# EasyEDA Pro project STC8H1K16.epro

# Schematic Schematic1
Create Date: 2022-12-16; Page Name: P1; Project Name: STC8H1K16; Schematic Name: Schematic1; Update Date: 2022-12-17; Company: 嘉立创EDA; Page Size: A3; Version: V1.0
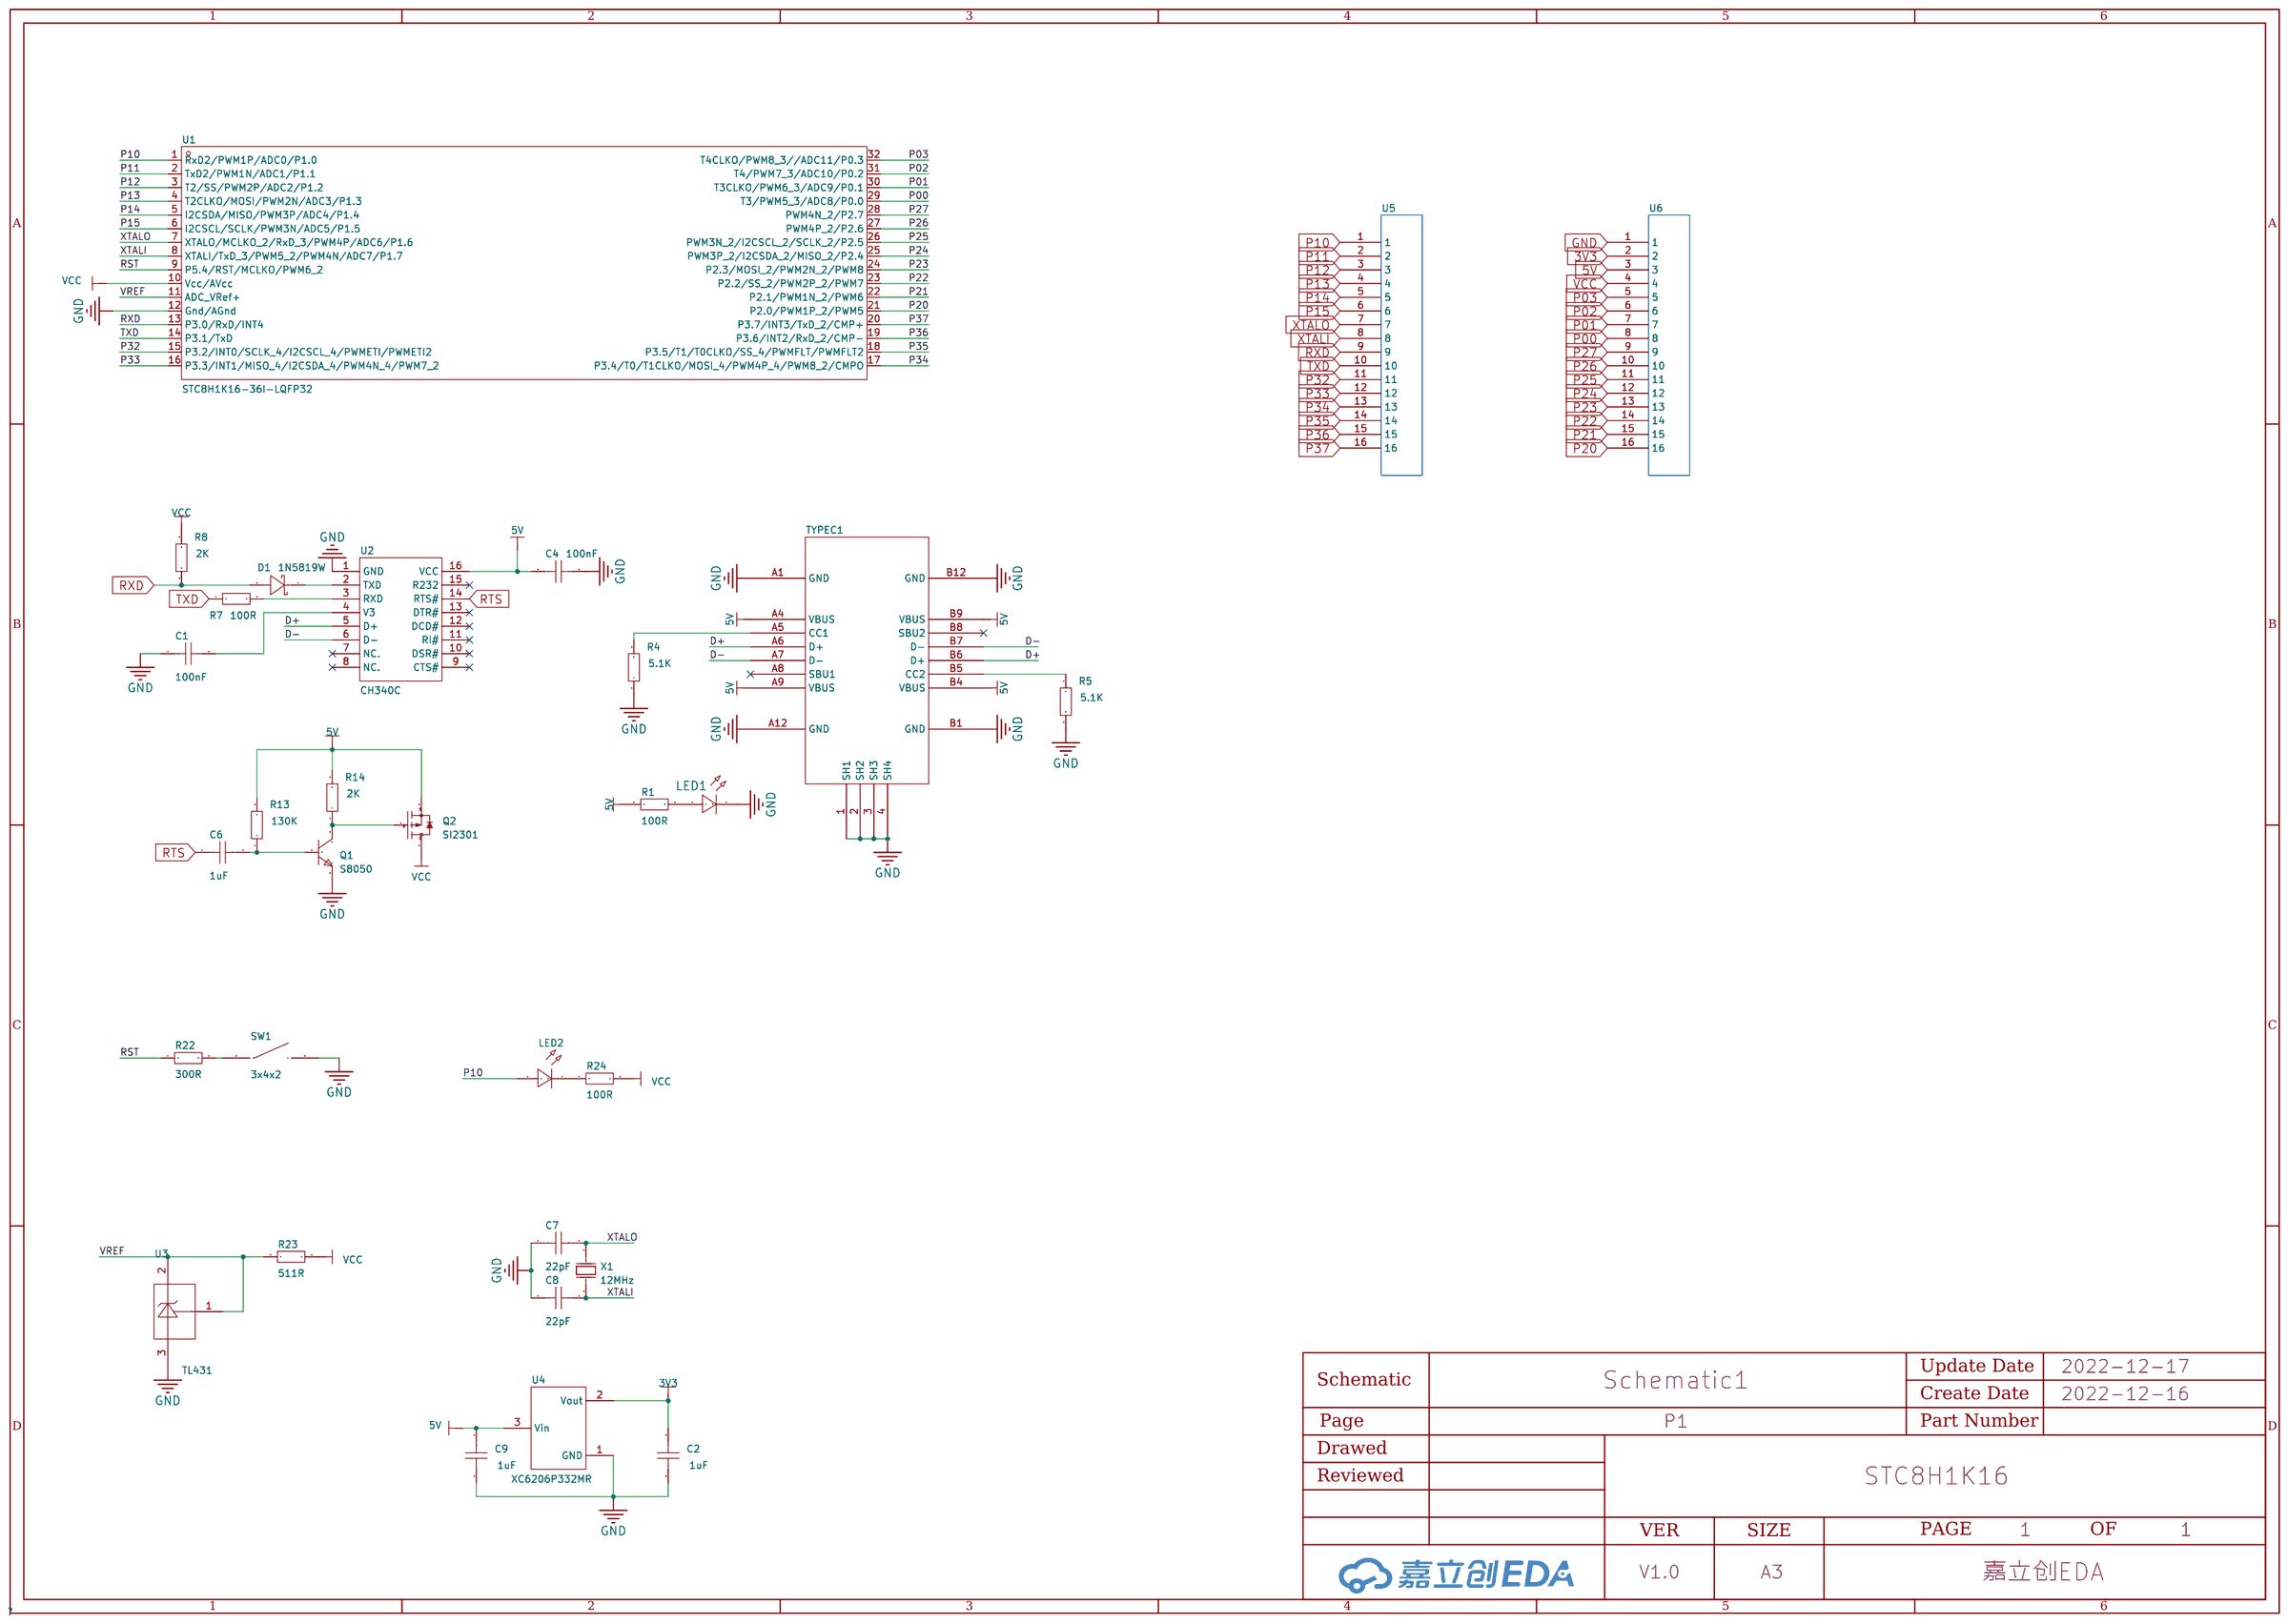
[diagram p0: schematic sheet]

## Parts
C1  100nF  [C0603]
C2  1uF  [C0603]
C4  100nF  [C0603]
C6  100nF  [C0603]
C7  22pF  [C0603]
C8  22pF  [C0603]
C9  1uF  [C0603]
D1  1N5819W  [SOD-323_L1.7-W1.3-LS2.6-RD-1]
LED1  -  [LED0805-RD_RED]
LED2  -  [LED_0805]
Q1  S8050  [SOT-23-3_L2.9-W1.3-P1.90-LS2.4-BR]
Q2  SI2301  [SOT-23-3_L2.9-W1.6-P1.90-LS2.8-BR]
R1  10K  [R0603]
R4  10K  [R0603]
R5  10K  [R0603]
R7  10K  [R0603]
R8  10K  [R0603]
R13  10K  [R0603]
R14  10K  [R0603]
R22  300R  [R0603]
R23  511R  [R0603]
R24  100R  [R0603]
SW1  3x4x2  [SW-SMD_L4.0-W2.9-LS5.0]
TYPEC1  -  [TypeC-16p]
U1  STC8H1K16-36I-LQFP32  [LQFP-32_L7.0-W7.0-P0.80-LS9.0-BL]
U2  CH340C  [SOP-16_L10.0-W3.9-P1.27-LS6.0-BL]
U3  TL431  [SOT-23-3_L2.9-W1.3-P1.90-LS2.4-BR]
U4  XC6206P332MR  [SOT-23-3_L2.9-W1.6-P1.90-LS2.8-BR]
U5  -  [Header-16P-2.54]
U6  -  [Header-16P-2.54]
X1  12MHz  [OSC-TH_L10.0-W4.5-P5.00]

## Library data of the parts
C1 C2 C4 C6-C9 = CAP_0603: Supplier Footprint: 0603
D1 = 1N5819WS S4: 二极管配置:-;直流反向耐压(Vr):40V;平均整流电流(Io):350mA;正向压降(Vf):600mV@200mA;反向电流(Ir):5A@30V;; LCSC Part Name: 40V 350mA 600mV@200mA; Supplier Part: C2939001; Manufacturer: KUU; Supplier Footprint: SOD-323; JLCPCB Part Class: 扩展库; Datasheet: https://atta.szlcsc.com/upload/public/pdf/source/20220104/284BA42B17809E9E0DF150FD0918852F.pdf; Supplier: LCSC; Reverse Voltage (Vr): 40V; Average Rectified Current (Io): 350mA; Forward Voltage (Vf@If): 600mV@200mA; Reverse Leakage Current (Ir): 5A@30V
LED1 = LED_0805-R: Supplier Footprint: 0805
LED2 = LED_0805-G: Supplier Footprint: 0805
Q1 = S8050: NPN 25V 500mA 120-400 SOT-23; Supplier Part: C2931719; Manufacturer: Doeshare(德芯); Supplier Footprint: SOT-23; JLCPCB Part Class: 扩展库; Datasheet: https://atta.szlcsc.com/upload/public/pdf/source/20220117/E6D3315E0D6ADDB25840BFFAC039C5C0.pdf; Supplier: LCSC
Q2 = SI2301_C2985938: 类型:P沟道;漏源电压(Vdss):20V;连续漏极电流(Id):3A;功率(Pd):1.25W;导通电阻(RDS(on)@Vgs,Id):90mΩ@4.5V,2.8A;阈值电压(Vgs(th)@Id):1V@250uA;栅极电荷(Qg@Vgs):10nC@4.5V;输入电容(Ciss@Vds):589pF@16V;反向传输电容(Crss@Vds):68pF@10V;工作温度:+150@(Tj);; LCSC Part Name: P沟道 20V 3A; Supplier Part: C2985938; Manufacturer: KUU; Supplier Footprint: SOT-23-3L; JLCPCB Part Class: 扩展库; Datasheet: https://atta.szlcsc.com/upload/public/pdf/source/20220328/BAD282C8065BB2F010ED3B5450E4D439.pdf; Supplier: LCSC; Type: P沟道; Drain Source Voltage (Vdss): 20V; Continuous Drain Current (Id): 3A; Power Dissipation (Pd): 1.25W; Drain Source On Resistance (RDS(on)@Vgs,Id): 90mΩ@4.5V,2.8A; Gate Threshold Voltage (Vgs(th)@Id): 1V@250uA; Total Gate Charge (Qg@Vgs): 10nC@4.5V; Input Capacitance (Ciss@Vds): 589pF@16V; Reverse Transfer Capacitance (Crss@Vds): 68pF@10V; Operating Temperature: +150@(Tj)
R1 R4 R5 R7 R8 R13 R14 R22-R24 = Res_0603: Supplier Footprint: 0603
SW1 = TS-1185-C-A-B-B: 触点电流:50mA;额定电压(DC):12V;绝缘电阻:100mΩ;电路结构:单刀单掷;安装方式:立贴;按钮形状:圆形按钮;按钮/盖帽颜色:蓝色;带灯:无;作用力:260gf;机械寿命:100000;工作温度:-30~+85;开关长度:4mm;开关宽度:3mm;开关高度:2mm;带支架:否;; LCSC Part Name: 3*4*2.0硅胶260gf; Supplier Part: C465999; Manufacturer: XKB Connectivity(中国星坤); Supplier Footprint: SMD; JLCPCB Part Class: 扩展库; Datasheet: https://atta.szlcsc.com/upload/public/pdf/source/20211011/1F231F77C87DDA3AFCA2BCBA34277182.pdf; Supplier: LCSC; Contact Current: 50mA; Voltage Rating (DC): 12V; Insulation Resistance: 100mΩ; Circuit: 单刀单掷; Mounting Style: 立贴; Actuator Style: 圆形按钮; Actuator/Cap Color: 蓝色; With Lamp: 无; Operating Force: 260gf; Mechanical Life: 100000; Operating Temperature: -30~+85; Switch Length: 4mm; Switch Width: 3mm; Switch Height: 2mm; Strike Gundam: 否
TYPEC1 = TypeC-16P
U1 = STC8H1K16-36I-LQFP32: Supplier Part: C914617; Manufacturer: STC(宏晶); Supplier Footprint: LQFP-32; JLCPCB Part Class: 扩展库; Datasheet: https://atta.szlcsc.com/upload/public/pdf/source/20220208/F43AF8AFB82417D1483669F3A0ABE01D.pdf; Supplier: LCSC
U2 = CH340C: 类型:Transceiver;协议类别:USB 2.0;驱动器/接收器数:-;数据速率:2Mbps;; Supplier Part: C84681; Manufacturer: WCH(南京沁恒); Supplier Footprint: SOP-16_150mil; JLCPCB Part Class: 扩展库; Datasheet: https://atta.szlcsc.com/upload/public/pdf/source/20200819/C84681_ADBED554CE321879DBD6B1D06488689C.pdf; Supplier: LCSC; Type: Transceiver; Protocol: USB 2.0; Data Rate: 2Mbps; Supply Voltage: 3.3V, 5V
U3 = TL431_C2904832: 电压基准类型:并联;输出类型:可调;输入电压:37V;输出电压:2.5V~36V;输出电流:-;精度:1%;温度系数:-;静态电流:-;最小阴极电流调节:1mA;噪声(0.1Hz-10Hz):-;噪声(10Hz-10kHz):-;动态阻抗:0.15Ω;工作温度:-25℃~+85℃@(Topr);; LCSC Part Name: 并联 2.5V~36V; Supplier Part: C2904832; Manufacturer: YONGYUTAI(永裕泰); Supplier Footprint: SOT-23; JLCPCB Part Class: 扩展库; Datasheet: https://atta.szlcsc.com/upload/public/pdf/source/20211011/73AEA5281D6620D507A69EF0BBD25925.pdf; Supplier: LCSC; Reference Type: 并联; Output Type: 可调; Input Voltage: 37V; Output Voltage: 2.5V~36V; Tolerance: 1%; Minimum Cathode Current for Regulation: 1mA; Dynamic Impedance: 0.15Ω; Operating Temperature: -25℃~+85℃@(Topr)
U4 = XC6206P332MR_C5446: 输出类型:固定;输出极性:正;输出通道数:1;最大输入电压:6V;输出电压:3.3V;压差:680mV@(100mA);输出电流:200mA;电源纹波抑制比(PRSS):-;; LCSC Part Name: Vin=6V Vout=3.3V 200mA; Supplier Part: C5446; Manufacturer: TOREX(特瑞仕); Supplier Footprint: SOT-23-3L; JLCPCB Part Class: 基础库; Datasheet: https://atta.szlcsc.com/upload/public/pdf/source/20130801/1457706628791.pdf; Supplier: LCSC; Output Type: 固定; Output Polarity: 正; Number of Outputs: 1; Maximum Input Voltage: 6V; Output Voltage: 3.3V; Dropout Voltage: 680mV@(100mA); Output Current: 200mA
U5 U6 = Header-16P-2.54: 2.54 mm 排针
X1 = X49SD294912MSD2SC: 晶振类型:49S晶振;频率:29.4912MHz;频率公差:±20ppm;频率稳定度:±30ppm;负载电容:20pF;工作温度:-20℃~+70℃;; LCSC Part Name: HC-49US 29.4912MHz ±20ppm 20pF; Supplier Part: C2219; Manufacturer: YXC(扬兴晶振); Supplier Footprint: HC-49S-2P; JLCPCB Part Class: 扩展库; Datasheet: https://atta.szlcsc.com/upload/public/pdf/source/20210903/A997D130AE99CBB55D9024F9BE6DA174.pdf; Supplier: LCSC; Crystal Type: 49S晶振; Frequency Tolerance: ±20ppm; Frequency Stability: ±30ppm; Load Capacitance: 20pF; Operating Temperature: -20℃~+70℃

## Nets
3V3: C2.2 U4.2(Vout) U6.2
5V: C4.2 C9.2 Q2.2(S) R1.1 R13.2 R14.2 TYPEC1.A4(VBUS) TYPEC1.A9(VBUS) TYPEC1.B4(VBUS) TYPEC1.B9(VBUS) U2.16(VCC) U4.3(Vin) U6.3
GND: C1.1 C2.1 C4.1 C7.1 C8.1 C9.1 LED1.1(C) Q1.2(E) R4.1 R5.2 SW1.2 TYPEC1.1(SH1) TYPEC1.2(SH2) TYPEC1.3(SH3) TYPEC1.4(SH4) TYPEC1.A1(GND) TYPEC1.A12(GND) TYPEC1.B1(GND) TYPEC1.B12(GND) U1.12(Gnd/AGnd) U2.1(GND) U3.3(A) U4.1(GND) U6.1
VCC: Q2.3(D) R8.2 R23.2 R24.2 U1.10(Vcc/AVcc) U6.4
D+: TYPEC1.A6(D+) TYPEC1.B6(D+) U2.5(D+)
D-: TYPEC1.A7(D-) TYPEC1.B7(D-) U2.6(D-)
P00: U1.29(T3/PWM5_3/ADC8/P0.0) U6.8
P01: U1.30(T3CLKO/PWM6_3/ADC9/P0.1) U6.7
P02: U1.31(T4/PWM7_3/ADC10/P0.2) U6.6
P03: U1.32(T4CLKO/PWM8_3//ADC11/P0.3) U6.5
P10: LED2.2(A) U1.1(RxD2/PWM1P/ADC0/P1.0) U5.1
P11: U1.2(TxD2/PWM1N/ADC1/P1.1) U5.2
P12: U1.3(T2/SS/PWM2P/ADC2/P1.2) U5.3
P13: U1.4(T2CLKO/MOSI/PWM2N/ADC3/P1.3) U5.4
P14: U1.5(I2CSDA/MISO/PWM3P/ADC4/P1.4) U5.5
P15: U1.6(I2CSCL/SCLK/PWM3N/ADC5/P1.5) U5.6
P20: U1.21(P2.0/PWM1P_2/PWM5) U6.16
P21: U1.22(P2.1/PWM1N_2/PWM6) U6.15
P22: U1.23(P2.2/SS_2/PWM2P_2/PWM7) U6.14
P23: U1.24(P2.3/MOSI_2/PWM2N_2/PWM8) U6.13
P24: U1.25(PWM3P_2/I2CSDA_2/MISO_2/P2.4) U6.12
P25: U1.26(PWM3N_2/I2CSCL_2/SCLK_2/P2.5) U6.11
P26: U1.27(PWM4P_2/P2.6) U6.10
P27: U1.28(PWM4N_2/P2.7) U6.9
P32: U1.15(P3.2/INT0/SCLK_4/I2CSCL_4/PWMETI/PWMETI2) U5.11
P33: U1.16(P3.3/INT1/MISO_4/I2CSDA_4/PWM4N_4/PWM7_2) U5.12
P34: U1.17(P3.4/T0/T1CLKO/MOSI_4/PWM4P_4/PWM8_2/CMPO) U5.13
P35: U1.18(P3.5/T1/T0CLKO/SS_4/PWMFLT/PWMFLT2) U5.14
P36: U1.19(P3.6/INT2/RxD_2/CMP-) U5.15
P37: U1.20(P3.7/INT3/TxD_2/CMP+) U5.16
RST: R22.1 U1.9(P5.4/RST/MCLKO/PWM6_2)
RTS: C6.1 U2.14(RTS#)
RXD: D1.2(A) R8.1 U1.13(P3.0/RxD/INT4) U5.9
TXD: R7.1 U1.14(P3.1/TxD) U5.10
VREF: R23.1 U1.11(ADC_VRef+) U3.1(REF) U3.2(K)
XTALI: C8.2 U1.8(XTALI/TxD_3/PWM5_2/PWM4N/ADC7/P1.7) U5.8 X1.2(OSC2)
XTALO: C7.2 U1.7(XTALO/MCLKO_2/RxD_3/PWM4P/ADC6/P1.6) U5.7 X1.1(OSC1)
$1N1368: R7.2 U2.3(RXD)
$1N1373: C1.2 U2.4(V3)
$1N1374: D1.1(K) U2.2(TXD)
$1N1821: C6.2 Q1.1(B) R13.1
$1N1822: Q1.3(C) Q2.1(G) R14.1
$1N2730: LED1.2(A) R1.2
$1N2745: R4.2 TYPEC1.A5(CC1)
$1N2747: R5.1 TYPEC1.B5(CC2)
$1N3640: R22.2 SW1.1
$1N4944: LED2.1(C) R24.1

Not connected (* = marked no-connect by the designer): TYPEC1 A8(SBU1)* B8(SBU2)*; U2 7(NC.)* 8(NC.)* 9(CTS#)* 10(DSR#)* 11(RI#)* 12(DCD#)* 13(DTR#)* 15(R232)*

# Board PCB1
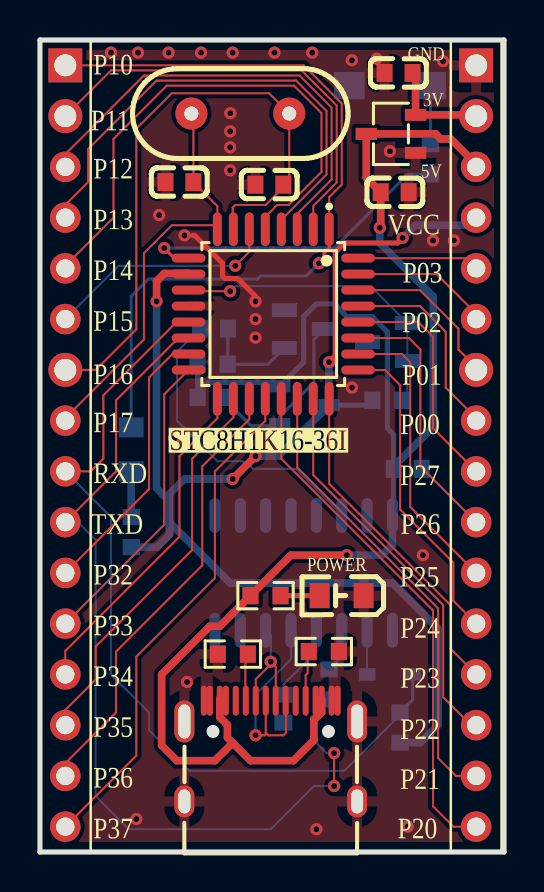
[diagram p1: board, top side]
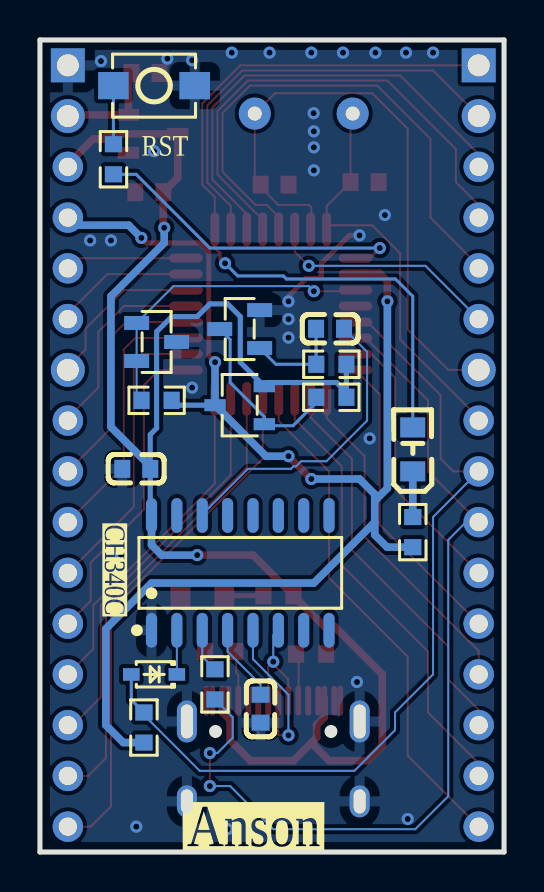
[diagram p2: board, bottom side, seen from below]

Outline 23.24 x 40.64 mm; copper layers: Top Layer, Bottom Layer. Coordinates in mm from the lower left corner of the outline.
Outline path: 0,40.64 0,0 23.24,0 23.24,40.64 0,40.64
Stack: Top Layer 0.035mm / Dielectric1 1.51mm FR4 er 4.5 / Bottom Layer 0.035mm

## Design rules (mm)
spacing safeClearance (default): track to track 0.152, other pairs 0.152 to 0.3
track width trackWidth (default): min 0.102, default 0.254, max 2.54
differential pair differentialPair (default): width min 0.127, default 0.254, max 2.54; gap min 0.152, default 0.152
via viaSize (default): diameter min 0.5, default 0.61, max 10; hole min 0.3, default 0.305, max 6
net GND uses copperRegion1

## Placement (name value [footprint] x y rotation side)
C1  100nF  [C0603]  12.19 7.17 90 bottom
C2  1uF  [C0603]  17.96 38.99 0 top
C4  100nF  [C0603]  18.41 19.18 180 bottom
C6  100nF  [C0603]  8.71 26.19 0 bottom
C7  22pF  [C0603]  11.49 33.4 0 top
C8  22pF  [C0603]  6.99 33.53 0 top
C9  1uF  [C0603]  17.76 33.02 180 top
D1  1N5819W  [SOD-323_L1.7-W1.3-LS2.6-RD-1]  17.53 8.89 0 bottom
LED1  -  [LED0805-RD_RED]  15.11 12.83 180 top
LED2  -  [LED_0805]  4.57 20.2 90 bottom
Q1  S8050  [SOT-23-3_L2.9-W1.3-P1.90-LS2.4-BR]  13.24 26.17 180 bottom
Q2  SI2301  [SOT-23-3_L2.9-W1.6-P1.90-LS2.8-BR]  13.24 22.36 180 bottom
R1  10K  [R0603]  11.3 12.83 0 top
R4  10K  [R0603]  9.66 9.91 0 top
R5  10K  [R0603]  14.22 10.03 0 top
R7  10K  [R0603]  14.48 8.39 90 bottom
R8  10K  [R0603]  18.03 6.23 270 bottom
R13  10K  [R0603]  8.65 24.41 180 bottom
R14  10K  [R0603]  8.65 22.76 180 bottom
R22  300R  [R0603]  19.56 34.67 90 bottom
R23  511R  [R0603]  17.4 22.61 180 bottom
R24  100R  [R0603]  4.57 16.01 270 bottom
SW1  3x4x2  [SW-SMD_L4.0-W2.9-LS5.0]  17.53 38.35 180 bottom
TYPEC1  -  [TypeC-16p]  11.56 4.06 270 top
U1  STC8H1K16-36I-LQFP32  [LQFP-32_L7.0-W7.0-P0.80-LS9.0-BL]  11.68 26.92 180 top
U2  CH340C  [SOP-16_L10.0-W3.9-P1.27-LS6.0-BL]  13.21 13.97 180 bottom
U3  TL431  [SOT-23-3_L2.9-W1.3-P1.90-LS2.4-BR]  17.4 25.53 0 bottom
U4  XC6206P332MR  [SOT-23-3_L2.9-W1.6-P1.90-LS2.8-BR]  17.58 35.94 0 top
U5  -  [Header-16P-2.54]  0 40.64 270 top
U6  -  [Header-16P-2.54]  20.57 40.64 270 top
X1  12MHz  [OSC-TH_L10.0-W4.5-P5.00]  10.03 36.96 270 top

## Footprints (pads in the part's own frame, mm; a bottom-side part is the same pattern mirrored in y, then rotated)
C0603
  rect 0.8x0.9 smd: 1(-0.7,0) 2(0.7,0)
Header-16P-2.54
  rect 1.7x1.7 hole 1.1: 1(1.27,1.27)
  round 1.7 hole 1.1: 2(3.81,1.27) 7(16.51,1.27)
  round 1.524 hole 0.914: 3(6.35,1.27) 4(8.89,1.27) 5(11.43,1.27) 6(13.97,1.27) 8(19.05,1.27) 9(21.59,1.27) 10(24.13,1.27) 11(26.67,1.27) 12(29.21,1.27) 13(31.75,1.27) 14(34.29,1.27) 15(36.83,1.27) 16(39.37,1.27)
LED0805-RD_RED
  rect 1x1.25 smd: 1(-1.1,0) 2(1.1,0)
LED_0805
  rect 1x1.25 smd: 1(-1.15,0.005) 2(1.05,0.005)
LQFP-32_L7.0-W7.0-P0.80-LS9.0-BL
  oval 0.448x1.684 smd: 1(-2.8,-4.242) 2(-2,-4.242) 3(-1.2,-4.242) 4(-0.4,-4.242) 5(0.4,-4.242) 6(1.2,-4.242) 7(2,-4.242) 8(2.8,-4.242) 17(2.8,4.242) 18(2,4.242) 19(1.2,4.242) 20(0.4,4.242) 21(-0.4,4.242) 22(-1.2,4.242) 23(-2,4.242) 24(-2.8,4.242)
  oval 1.684x0.448 smd: 9(4.242,-2.8) 10(4.242,-2) 11(4.242,-1.2) 12(4.242,-0.4) 13(4.242,0.4) 14(4.242,1.2) 15(4.242,2) 16(4.242,2.8) 25(-4.242,2.8) 26(-4.242,2) 27(-4.242,1.2) 28(-4.242,0.4) 29(-4.242,-0.4) 30(-4.242,-1.2) 31(-4.242,-2) 32(-4.242,-2.8)
OSC-TH_L10.0-W4.5-P5.00
  round 1.6 hole 0.701: 1(0,2.451) 2(0,-2.451)
R0603
  rect 0.806x0.864 smd: 1(-0.753,0) 2(0.753,0)
SOD-323_L1.7-W1.3-LS2.6-RD-1
  rect 0.831x0.63 smd: 1(-1.141,0) 2(1.141,0)
SOP-16_L10.0-W3.9-P1.27-LS6.0-BL
  oval 0.56x1.745 smd: 1(-4.445,-2.873) 2(-3.175,-2.873) 3(-1.905,-2.873) 4(-0.635,-2.873) 5(0.635,-2.873) 6(1.905,-2.873) 7(3.175,-2.873) 8(4.445,-2.873) 9(4.445,2.873) 10(3.175,2.873) 11(1.905,2.873) 12(0.635,2.873) 13(-0.635,2.873) 14(-1.905,2.873) 15(-3.175,2.873) 16(-4.445,2.873)
SOT-23-3_L2.9-W1.3-P1.90-LS2.4-BR
  rect 1.25x0.7 smd: 1(1,-0.95) 2(1,0.95) 3(-1,0)
SOT-23-3_L2.9-W1.6-P1.90-LS2.8-BR
  rect 1.07x0.6 smd: 1(1.235,-0.95) 2(1.235,0.95) 3(-1.235,0)
SW-SMD_L4.0-W2.9-LS5.0
  rect 1.53x1.36 smd: 1(-2.035,0) 2(2.035,0)
TypeC-16p
  oval 2.1x1 hole 1.7x0.6: 1(-2.47,-4.325) 4(-2.47,4.325)
  oval 1.6x1 hole 1.2x0.6: 2(1.53,-4.325) 3(1.53,4.325)
  rrect 1.5x0.3 smd: A1(-3.51,-3.35) A4(-3.51,-2.55) A5(-3.51,-1.25) A6(-3.51,-0.25) A7(-3.51,0.25) A8(-3.51,1.25) A9(-3.51,2.55) A12(-3.51,3.35) B1(-3.51,3.05) B4(-3.51,2.25) B5(-3.51,1.75) B6(-3.51,0.75) B7(-3.51,-0.75) B8(-3.51,-1.75) B9(-3.51,-2.25) B12(-3.51,-3.05)

## Nets
As in the schematic.

Pads without a net: TYPEC1 A8 B8; U2 7 8 9 10 11 12 13 15

## Via types
v1: diameter 0.61, hole 0.305, Top Layer to Bottom Layer, 44 vias

## Routing (per net, layer and track width the routed paths; a pad name or vN(x,y) marks a point on that pad's centre or on a via; arc(x,y) is an arc through that point)
3V3: length 5.3
  Top Layer w0.381: 21.97,36.83 21.91,36.89 U4.2 18.81,38.83 C2.2
5V: length 82.7
  Top Layer w0.381: 9.65,5.46 9.39,5.72 9.39,6.36 9.01,6.74 9.01,7.7 ; 9.65,5.46 10.54,4.57 12.7,4.57 13.72,5.59 13.72,6.6 14.11,7 14.11,7.7 ; 9.65,5.46 8.76,4.57 6.86,4.57 6.1,5.33 6.1,8.89 8.51,11.3 9.02,11.3 10.54,12.83 12.57,14.86 v1(15.37,14.86) ; 21.97,34.29 20.57,35.69 20.07,35.69 19.81,35.94 U4.3 16.34,33.74 C9.2 17.06,31.29 v1(17.02,31.24)
  Bottom Layer w0.152: 7.9,23.01 R14.2
  Bottom Layer w0.254: R13.2 7.9,23.01 8.38,23.5 11.82,23.5 Q2.2 12.01,23.31 13.21,24.51 13.21,26.8 13.84,27.43 14.73,27.43 15.37,26.8 16.64,26.8 17.4,26.03 17.4,21.21 17.72,20.89 17.72,16.91 U2.16
  Bottom Layer w0.381: v1(15.37,14.86) 17.15,14.86 17.65,15.37 U2.16 ; 17.72,19.3 19.69,21.27 19.69,27.81 17.02,30.48 v1(17.02,31.24)
GND: length 5.1
  Top Layer w0.254: v1(10.79,27.56) 10.79,27.81 9.91,28.7 9.27,28.7 9.14,28.83 9.14,29.46 7.75,30.86 7.62,30.86
  vias: v1(3.56,40) v1(4.83,1.65) v1(4.91,40) v1(5.97,31.88) v1(6.44,40) v1(6.73,20.7) v1(7.24,30.86) v1(7.37,8.51) v1(8.07,40) v1(9.54,36.98) v1(9.53,36.07) v1(9.53,35.27) v1(9.53,34.12) v1(9.65,40) v1(10.79,26.67) v1(10.79,25.74) v1(11.74,40) v1(13.64,40) v1(13.84,1.14) v1(15.62,39.62) v1(15.62,23.24) v1(16.86,39.7) v1(17.53,35.07) v1(18.41,1.27) v1(19.18,14.86) v1(19.69,30.61) v1(20.18,39.58) v1(20.73,30.61)
VCC: length 67.7
  Top Layer w0.254: v1(18.16,30.73) 17.91,30.48 15.24,30.48 14.79,30.03 14.79,24.83 v1(14.47,24.52)
  Top Layer w0.381: v1(5.84,27.56) 5.84,28.58 6.22,28.96 7.41,28.96 U1.10 ; v1(9.65,18.67) v1(10.79,19.81)
  Bottom Layer w0.254: Q2.3 16.4,22.36 R23.2
  Bottom Layer w0.381: 6.48,16.51 6.48,15.88 5.86,15.26 4.57,15.26 ; 6.48,16.51 9.53,13.46 17.65,13.46 19.94,11.18 19.94,6.35 19.07,5.48 R8.2 ; 6.48,16.51 6.48,17.57 ; U6.4 21.46,31.37 18.8,31.37 v1(18.16,30.73) ; v1(10.79,19.81) 11.92,19.81 Q2.3 v1(14.47,24.52) ; 6.48,17.57 6.48,17.91 7.24,18.67 v1(9.65,18.67) ; 6.48,17.57 5.84,18.21 v1(5.84,27.56)
D+: length 11.2
  Top Layer w0.102: 11.35,5.93 11.26,5.84 v1(10.79,5.84) ; 11.35,5.93 11.43,5.84 12.19,5.84 12.32,5.97 12.32,7.69 12.31,7.7 ; 11.35,5.93 11.31,5.97 11.31,7.7
  Bottom Layer w0.102: U2.5 12.57,9.65 10.79,7.87 v1(10.79,5.84)
D-: length 5.7
  Top Layer w0.102: 10.81,7.7 10.81,8.65 11.56,9.4 v1(11.56,9.53) 11.81,9.27 11.81,7.7 11.81,7.7
  Bottom Layer w0.102: U2.6 11.56,10.84 v1(11.56,9.53)
P00: length 10.1
  Top Layer w0.102: 21.97,21.59 20.32,23.24 20.32,26.03 19.03,27.32 U1.29
P01: length 8.3
  Top Layer w0.102: U1.30 19.03,28.12 20.96,26.19 20.96,25.15 21.97,24.13
P02: length 7.1
  Top Layer w0.102: 21.97,26.67 21.97,26.81 19.86,28.92 U1.31
P03: length 6.3
  Top Layer w0.102: U1.32 15.93,29.72 21.46,29.72 21.97,29.21
P10: length 39.8
  Top Layer w0.102: U5.1 13.21,39.37 15.11,37.47 15.11,33.4 14.48,32.77 U1.1
  Top Layer w0.152: U1.1 14.48,30.23 14.22,29.97 14.22,29.72 v1(13.97,29.46)
  Bottom Layer w0.152: LED2.2 4.57,27.81 5.44,28.68 10.9,28.68 11.05,28.83 13.34,28.83 v1(13.97,29.46)
P11: length 21.9
  Top Layer w0.102: U5.2 3.56,39.12 13.1,39.12 14.86,37.36 14.86,33.51 13.68,32.33 U1.2
P12: length 23.1
  Top Layer w0.102: U1.3 12.88,31.93 14.6,33.66 14.6,37.25 13,38.86 5.21,38.86 1.27,34.92 U5.3
P13: length 24.7
  Top Layer w0.102: U5.4 1.27,32.39 2.41,33.53 2.41,35.18 5.84,38.61 12.83,38.61 14.35,37.08 14.35,33.91 12.08,31.64 U1.4
P14: length 26.9
  Top Layer w0.102: U5.5 1.27,29.34 3.68,31.75 3.68,35.69 6.35,38.35 12.72,38.35 14.1,36.98 14.1,34.04 12.45,32.39 11.88,32.39 11.28,31.78 U1.5
P15: length 11.7
  Top Layer w0.102: v1(9.78,29.34) 10.48,30.04 U1.6
  Bottom Layer w0.102: v1(9.78,29.34) 3.94,29.34 U5.6
P20: length 26.1
  Top Layer w0.102: U1.21 12.08,19.69 19.69,12.09 19.69,2.29 20.7,1.27 U6.16
P21: length 23.2
  Top Layer w0.102: U6.15 20.83,3.81 19.94,4.7 19.94,12.19 12.88,19.25 U1.22
P22: length 19.9
  Top Layer w0.102: U6.14 21.59,6.35 20.19,7.75 20.19,12.36 13.68,18.87 U1.23
P23: length 16.8
  Top Layer w0.102: U1.24 14.48,18.43 20.57,12.34 20.57,10.16 U6.13
P24: length 15.9
  Top Layer w0.102: U1.25 17.28,24.12 18.03,23.37 18.03,17.14 20.7,14.48 20.7,12.57 U6.12
P25: length 14.7
  Top Layer w0.102: U6.11 18.54,17.27 18.54,24.51 18.13,24.92 U1.26
P26: length 13.2
  Top Layer w0.102: U6.10 19.05,19.3 19.05,25.15 18.47,25.72 U1.27
P27: length 11.7
  Top Layer w0.102: U1.28 18.94,26.52 19.69,25.78 19.69,21.21 U6.9
P32: length 14
  Top Layer w0.102: U5.11 5.46,18.16 5.46,23.75 6.64,24.92 U1.15
P33: length 15.3
  Top Layer w0.102: U1.16 6.22,22.91 6.22,16.38 U5.12
P34: length 16.9
  Top Layer w0.102: U5.13 1.27,10.06 6.99,15.78 6.99,19.81 8.88,21.71 U1.17
P35: length 19.8
  Top Layer w0.102: U1.18 9.68,21.75 7.62,19.69 7.62,15.11 2.79,10.29 2.79,8.64 1.27,7.11 U5.14
P36: length 22.7
  Top Layer w0.102: U5.15 1.27,4.44 3.81,6.98 3.81,10.03 8.13,14.35 8.13,19.3 10.48,21.66 U1.19
P37: length 25.6
  Top Layer w0.102: U5.16 4.83,4.83 4.83,9.78 8.76,13.72 8.76,19.05 11.28,21.57 U1.20
RST: length 16.3
  Top Layer w0.152: v1(6.22,30.23) 6.72,29.72 U1.9
  Bottom Layer w0.152: R22.1 18.42,33.92 14.73,30.23 v1(6.22,30.23)
RTS: length 15.3
  Bottom Layer w0.102: U2.14 15.11,16.89 12.83,19.18 10.67,19.18 10.54,19.3 10.41,19.3 10.16,19.56 8.89,19.56 6.86,21.59 6.86,25.03 C6.1
RXD: length 42.7
  Top Layer w0.102: U5.9 2.54,19.05 3.18,19.69 3.18,22.86 6.84,26.52 U1.13
  Bottom Layer w0.102: U5.9 3.56,16.76 3.56,8.89 5.46,6.98 5.46,6.1 7.49,4.06 15.24,4.06 18.03,6.86 R8.1
  Bottom Layer w0.152: R8.1 18.67,7.62 D1.2
TXD: length 45.7
  Top Layer w0.102: v1(14.73,4.95) v1(14.73,3.3) ; U1.14 6.93,25.72 3.81,22.61 3.81,19.05 U5.10
  Bottom Layer w0.102: v1(14.73,4.95) 14.35,4.95 13.59,5.72 13.59,6.75 14.48,7.64 ; U5.10 1.91,16.51 2.79,15.62 2.79,2.79 4.44,1.14 11.56,1.14 13.72,3.3 v1(14.73,3.3)
VREF: length 15.8
  Top Layer w0.102: U1.11 7.5,28.07 v1(9.53,28.07)
  Bottom Layer w0.102: v1(9.53,28.07) 9.78,28.32 16.56,28.32 U3.1 U3.2 18.4,22.85 R23.1
XTALI: length 20.7
  Top Layer w0.102: X1.2 7.69,36.85 C8.2 8.88,32.33 U1.8 8.68,31.37 6.6,31.37 5.21,29.97 5.21,25.65 1.27,21.72 U5.8
XTALO: length 31.1
  Top Layer w0.102: U1.7 9.65,31.2 9.65,32.26 9.78,32.39 11.3,32.39 11.94,33.02 11.94,33.15 C7.2 12.48,33.7 X1.1 11.47,37.97 6.6,37.97 4.83,36.19 4.83,26.16 2.79,24.13 U5.7
$1N1368: length 2.2
  Bottom Layer w0.102: U2.3 15.11,9.78 R7.2
$1N1373: length 3.9
  Bottom Layer w0.102: U2.4 13.84,10.03 12.19,8.38 C1.2
$1N1374: length 2.2
  Bottom Layer w0.102: D1.1 16.38,8.89 U2.2
$1N1821: length 5
  Bottom Layer w0.152: C6.2 9.41,24.42 R13.1 11.43,24.41 Q1.1
$1N1822: length 9.2
  Bottom Layer w0.152: R14.1 9.27,22.63 10.56,21.34 11.93,21.34 Q2.1 12,21.78 13.72,23.5 13.72,25.65 Q1.3
$1N2730: length 2
  Top Layer w0.254: R1.2 LED1.2
$1N2745: length 2.3
  Top Layer w0.102: R4.2 10.29,9.78 10.29,7.72 10.31,7.7
$1N2747: length 2.4
  Top Layer w0.102: 13.31,7.7 13.31,8.86 13.41,8.96 13.41,9.98 R5.1
$1N3640: length 2.9
  Bottom Layer w0.152: R22.2 19.56,35.43 SW1.1
$1N4944: length 2.3
  Bottom Layer w0.381: LED2.1 R24.1

## Copper pours and planes (outline as drawn; the poured copper is in the pictures)
GND on Top Layer: 0,40.64 23.24,40.64 23.24,0 0,0
GND on Bottom Layer: 0,40.64 23.24,40.64 23.24,0 0,0

## Text on the board
Bottom Silkscreen Layer: RST | CH340C | Anson
Top Silkscreen Layer: POWER | GND | 5V | 3V | P11 | TXD | P10 | P12 | P13 | P14 | P15 | P16 | P17 | RXD | P32 | P33 | P34 | P35 | P36 | P37 | STC8H1K16-36I | VCC | P20 | P25 | P00 | P27 | P24 | P23 | P22 | P21 | P26 | P02 | P01 | P03
